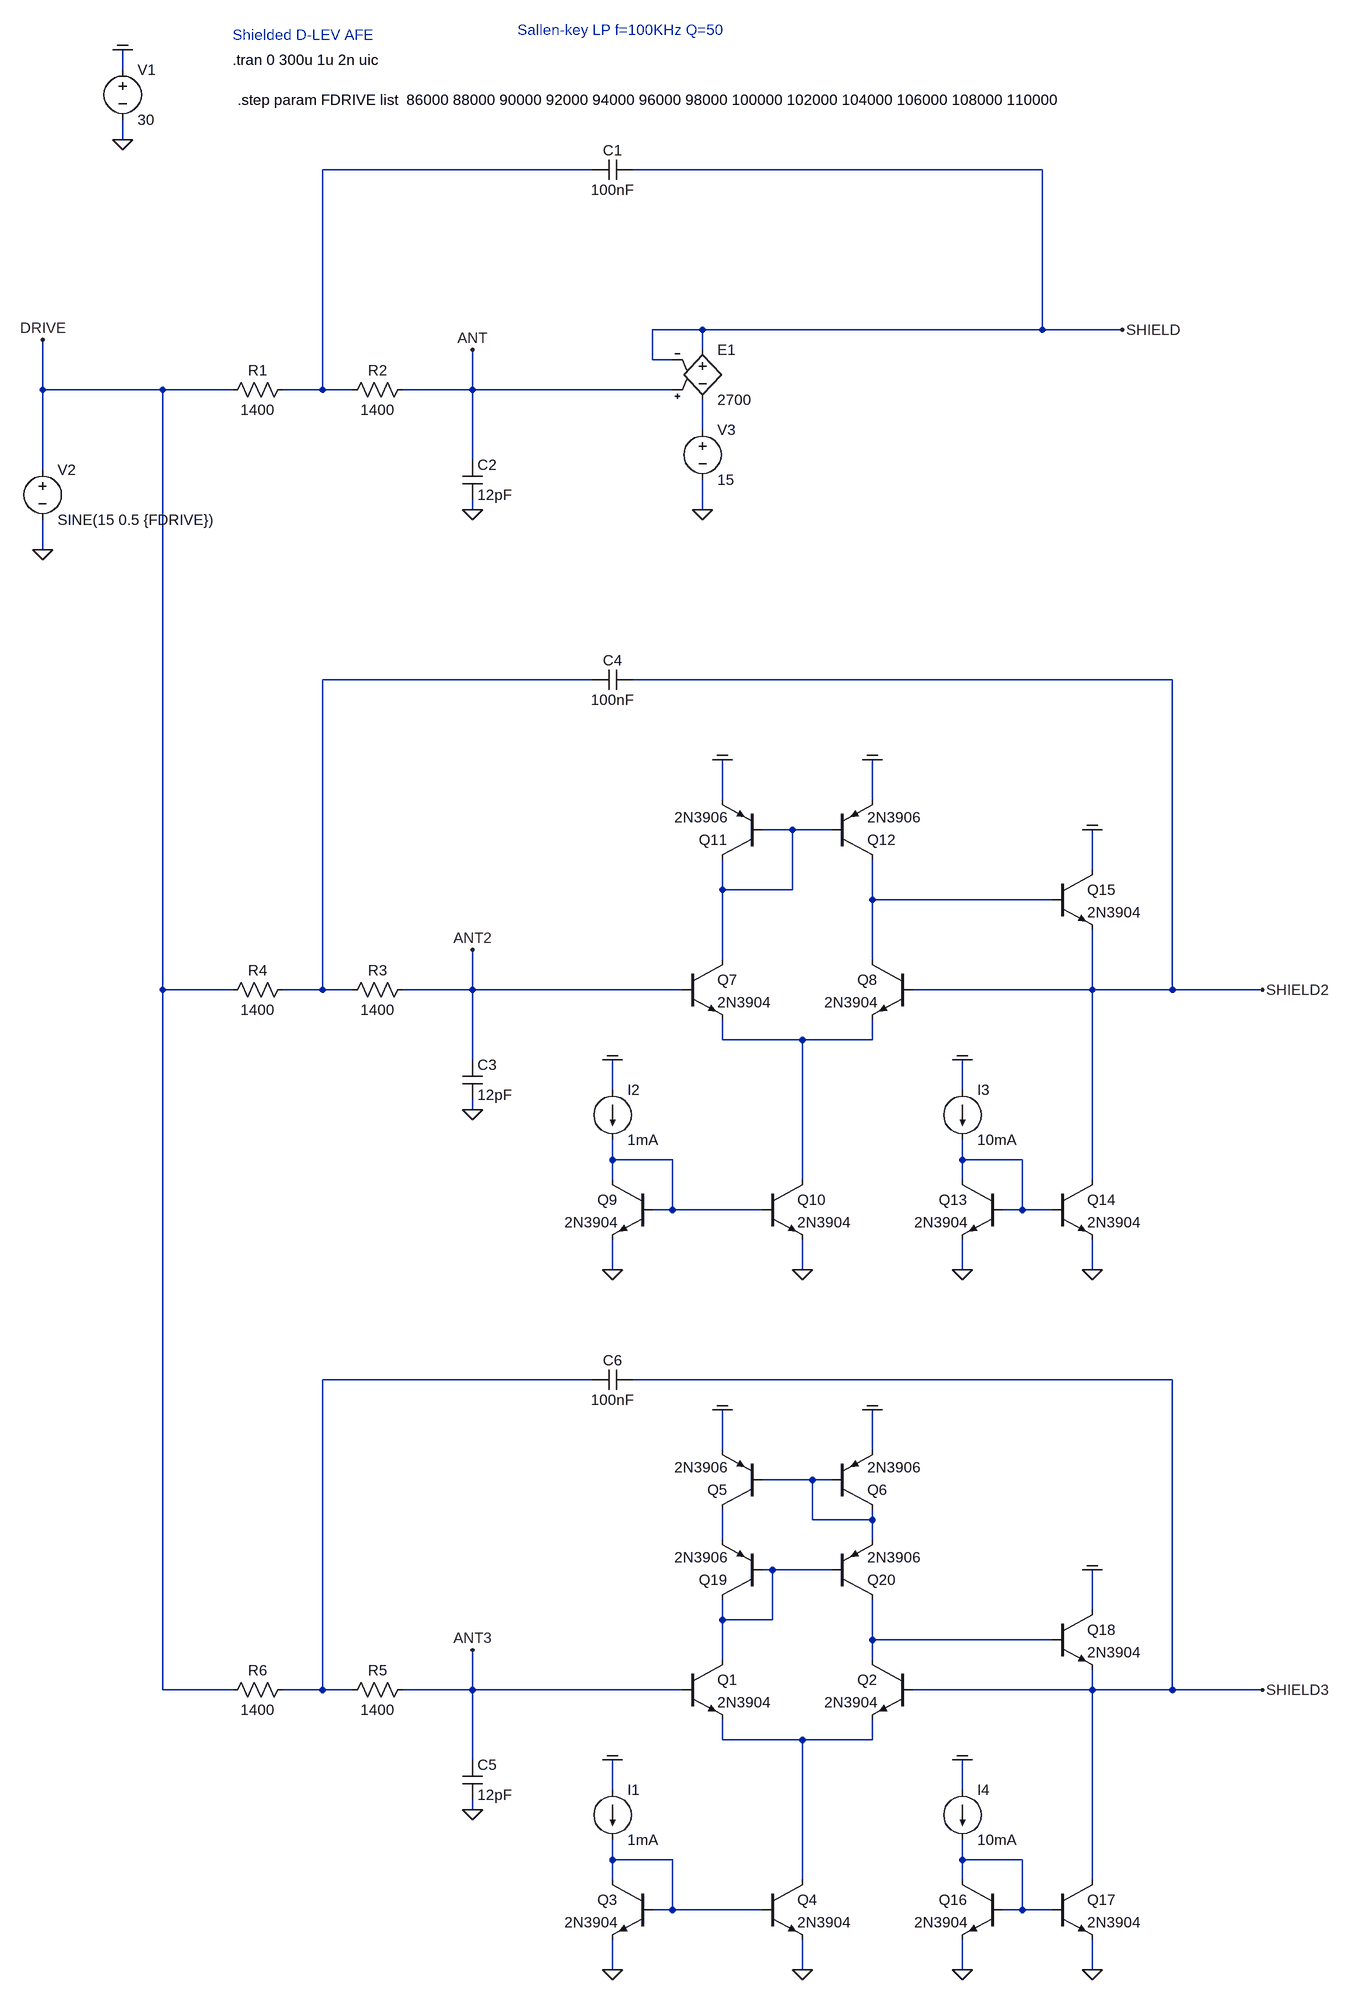
[diagram p0: schematic 2024_01_sallen_key_afe_v04.asc]
2024_01_sallen_key_afe_v04.asc, the LTspice schematic file:
Version 4
SHEET 1 21908 18388
WIRE 17712 14128 17712 14096
WIRE 17712 14240 17712 14208
WIRE 18464 14288 18032 14288
WIRE 19184 14288 18528 14288
WIRE 18640 14544 18560 14544
WIRE 19184 14544 19184 14288
WIRE 19184 14544 18640 14544
WIRE 19312 14544 19184 14544
WIRE 18640 14576 18640 14544
WIRE 18560 14592 18560 14544
WIRE 18592 14592 18560 14592
WIRE 17584 14640 17584 14560
WIRE 17776 14640 17584 14640
WIRE 17888 14640 17776 14640
WIRE 18032 14640 18032 14288
WIRE 18032 14640 17968 14640
WIRE 18080 14640 18032 14640
WIRE 18272 14640 18272 14576
WIRE 18272 14640 18160 14640
WIRE 18592 14640 18272 14640
WIRE 18640 14704 18640 14656
WIRE 18272 14752 18272 14640
WIRE 17584 14768 17584 14640
WIRE 18272 14832 18272 14816
WIRE 18640 14832 18640 14784
WIRE 17584 14896 17584 14848
WIRE 18464 15104 18032 15104
WIRE 19392 15104 18528 15104
WIRE 18672 15296 18672 15232
WIRE 18912 15296 18912 15232
WIRE 18784 15344 18736 15344
WIRE 18848 15344 18784 15344
WIRE 19264 15408 19264 15344
WIRE 18672 15440 18672 15392
WIRE 18784 15440 18784 15344
WIRE 18784 15440 18672 15440
WIRE 18912 15456 18912 15392
WIRE 19200 15456 18912 15456
WIRE 18672 15552 18672 15440
WIRE 18912 15552 18912 15456
WIRE 17776 15600 17776 14640
WIRE 17888 15600 17776 15600
WIRE 18032 15600 18032 15104
WIRE 18032 15600 17968 15600
WIRE 18080 15600 18032 15600
WIRE 18272 15600 18272 15536
WIRE 18272 15600 18160 15600
WIRE 18608 15600 18272 15600
WIRE 19264 15600 19264 15504
WIRE 19264 15600 18976 15600
WIRE 19392 15600 19392 15104
WIRE 19392 15600 19264 15600
WIRE 19536 15600 19392 15600
WIRE 18672 15680 18672 15648
WIRE 18800 15680 18672 15680
WIRE 18912 15680 18912 15648
WIRE 18912 15680 18800 15680
WIRE 18272 15712 18272 15600
WIRE 18496 15760 18496 15712
WIRE 19056 15760 19056 15712
WIRE 18272 15792 18272 15776
WIRE 18496 15872 18496 15840
WIRE 18592 15872 18496 15872
WIRE 19056 15872 19056 15840
WIRE 19152 15872 19056 15872
WIRE 18496 15904 18496 15872
WIRE 18800 15904 18800 15680
WIRE 19056 15904 19056 15872
WIRE 19264 15904 19264 15600
WIRE 18592 15952 18592 15872
WIRE 18592 15952 18560 15952
WIRE 18736 15952 18592 15952
WIRE 19152 15952 19152 15872
WIRE 19152 15952 19120 15952
WIRE 19200 15952 19152 15952
WIRE 18496 16048 18496 16000
WIRE 18800 16048 18800 16000
WIRE 19056 16048 19056 16000
WIRE 19264 16048 19264 16000
WIRE 18464 16224 18032 16224
WIRE 19392 16224 18528 16224
WIRE 18672 16336 18672 16272
WIRE 18912 16336 18912 16272
WIRE 18816 16384 18736 16384
WIRE 18848 16384 18816 16384
WIRE 18816 16448 18816 16384
WIRE 18912 16448 18912 16432
WIRE 18912 16448 18816 16448
WIRE 18672 16480 18672 16432
WIRE 18912 16480 18912 16448
WIRE 18752 16528 18736 16528
WIRE 18848 16528 18752 16528
WIRE 19264 16592 19264 16528
WIRE 18672 16608 18672 16576
WIRE 18752 16608 18752 16528
WIRE 18752 16608 18672 16608
WIRE 18912 16640 18912 16576
WIRE 19200 16640 18912 16640
WIRE 18672 16672 18672 16608
WIRE 18912 16672 18912 16640
WIRE 17776 16720 17776 15600
WIRE 17888 16720 17776 16720
WIRE 18032 16720 18032 16224
WIRE 18032 16720 17968 16720
WIRE 18080 16720 18032 16720
WIRE 18272 16720 18272 16656
WIRE 18272 16720 18160 16720
WIRE 18608 16720 18272 16720
WIRE 19264 16720 19264 16688
WIRE 19264 16720 18976 16720
WIRE 19392 16720 19392 16224
WIRE 19392 16720 19264 16720
WIRE 19536 16720 19392 16720
WIRE 18672 16800 18672 16768
WIRE 18800 16800 18672 16800
WIRE 18912 16800 18912 16768
WIRE 18912 16800 18800 16800
WIRE 18272 16832 18272 16720
WIRE 18496 16880 18496 16832
WIRE 19056 16880 19056 16832
WIRE 18272 16912 18272 16896
WIRE 18496 16992 18496 16960
WIRE 18592 16992 18496 16992
WIRE 19056 16992 19056 16960
WIRE 19152 16992 19056 16992
WIRE 18496 17024 18496 16992
WIRE 18800 17024 18800 16800
WIRE 19056 17024 19056 16992
WIRE 19264 17024 19264 16720
WIRE 18592 17072 18592 16992
WIRE 18592 17072 18560 17072
WIRE 18736 17072 18592 17072
WIRE 19152 17072 19152 16992
WIRE 19152 17072 19120 17072
WIRE 19200 17072 19152 17072
WIRE 18496 17168 18496 17120
WIRE 18800 17168 18800 17120
WIRE 19056 17168 19056 17120
WIRE 19264 17168 19264 17120
FLAG 17712 14240 0
FLAG 17712 14096 COM
FLAG 18272 14832 0
FLAG 17584 14896 0
FLAG 17584 14560 DRIVE
FLAG 18272 14576 ANT
FLAG 19312 14544 SHIELD
FLAG 18272 15792 0
FLAG 18272 15536 ANT2
FLAG 19536 15600 SHIELD2
FLAG 18496 16048 0
FLAG 18800 16048 0
FLAG 18496 15712 COM
FLAG 18672 15232 COM
FLAG 18912 15232 COM
FLAG 19056 16048 0
FLAG 19264 16048 0
FLAG 19056 15712 COM
FLAG 19264 15344 COM
FLAG 18640 14832 0
FLAG 18272 16912 0
FLAG 18272 16656 ANT3
FLAG 19536 16720 SHIELD3
FLAG 18496 17168 0
FLAG 18800 17168 0
FLAG 18496 16832 COM
FLAG 18672 16272 COM
FLAG 18912 16272 COM
FLAG 19056 17168 0
FLAG 19264 17168 0
FLAG 19056 16832 COM
FLAG 19264 16528 COM
SYMBOL voltage 17712 14112 R0
WINDOW 123 0 0 Left 0
WINDOW 39 0 0 Left 0
SYMATTR InstName V1
SYMATTR Value 30
SYMBOL cap 18256 14752 R0
SYMATTR InstName C2
SYMATTR Value 12pF
SYMBOL res 18176 14624 R90
WINDOW 0 0 56 VBottom 2
WINDOW 3 32 56 VTop 2
SYMATTR InstName R2
SYMATTR Value 1400
SYMBOL res 17984 14624 R90
WINDOW 0 0 56 VBottom 2
WINDOW 3 32 56 VTop 2
SYMATTR InstName R1
SYMATTR Value 1400
SYMBOL cap 18464 14272 M90
WINDOW 0 0 32 VBottom 2
WINDOW 3 32 32 VTop 2
SYMATTR InstName C1
SYMATTR Value 100nF
SYMBOL voltage 17584 14752 R0
WINDOW 123 0 0 Left 0
WINDOW 39 0 0 Left 0
SYMATTR InstName V2
SYMATTR Value SINE(15 0.5 {FDRIVE})
SYMBOL e2 18640 14560 R0
SYMATTR InstName E1
SYMATTR Value 2700
SYMBOL cap 18256 15712 R0
SYMATTR InstName C3
SYMATTR Value 12pF
SYMBOL res 18176 15584 R90
WINDOW 0 0 56 VBottom 2
WINDOW 3 32 56 VTop 2
SYMATTR InstName R3
SYMATTR Value 1400
SYMBOL res 17984 15584 R90
WINDOW 0 0 56 VBottom 2
WINDOW 3 32 56 VTop 2
SYMATTR InstName R4
SYMATTR Value 1400
SYMBOL cap 18464 15088 M90
WINDOW 0 0 32 VBottom 2
WINDOW 3 32 32 VTop 2
SYMATTR InstName C4
SYMATTR Value 100nF
SYMBOL npn 18608 15552 R0
SYMATTR InstName Q7
SYMATTR Value 2N3904
SYMBOL npn 18976 15552 M0
SYMATTR InstName Q8
SYMATTR Value 2N3904
SYMBOL npn 18560 15904 M0
SYMATTR InstName Q9
SYMATTR Value 2N3904
SYMBOL npn 18736 15904 R0
SYMATTR InstName Q10
SYMATTR Value 2N3904
SYMBOL pnp 18736 15392 R180
SYMATTR InstName Q11
SYMATTR Value 2N3906
SYMBOL pnp 18848 15392 M180
SYMATTR InstName Q12
SYMATTR Value 2N3906
SYMBOL current 18496 15760 R0
WINDOW 123 0 0 Left 0
WINDOW 39 0 0 Left 0
SYMATTR InstName I2
SYMATTR Value 1mA
SYMBOL npn 19120 15904 M0
SYMATTR InstName Q13
SYMATTR Value 2N3904
SYMBOL npn 19200 15904 R0
SYMATTR InstName Q14
SYMATTR Value 2N3904
SYMBOL current 19056 15760 R0
WINDOW 123 0 0 Left 0
WINDOW 39 0 0 Left 0
SYMATTR InstName I3
SYMATTR Value 10mA
SYMBOL npn 19200 15408 R0
SYMATTR InstName Q15
SYMATTR Value 2N3904
SYMBOL voltage 18640 14688 R0
WINDOW 123 0 0 Left 0
WINDOW 39 0 0 Left 0
SYMATTR InstName V3
SYMATTR Value 15
SYMBOL cap 18256 16832 R0
SYMATTR InstName C5
SYMATTR Value 12pF
SYMBOL res 18176 16704 R90
WINDOW 0 0 56 VBottom 2
WINDOW 3 32 56 VTop 2
SYMATTR InstName R5
SYMATTR Value 1400
SYMBOL res 17984 16704 R90
WINDOW 0 0 56 VBottom 2
WINDOW 3 32 56 VTop 2
SYMATTR InstName R6
SYMATTR Value 1400
SYMBOL cap 18464 16208 M90
WINDOW 0 0 32 VBottom 2
WINDOW 3 32 32 VTop 2
SYMATTR InstName C6
SYMATTR Value 100nF
SYMBOL npn 18608 16672 R0
SYMATTR InstName Q1
SYMATTR Value 2N3904
SYMBOL npn 18976 16672 M0
SYMATTR InstName Q2
SYMATTR Value 2N3904
SYMBOL npn 18560 17024 M0
SYMATTR InstName Q3
SYMATTR Value 2N3904
SYMBOL npn 18736 17024 R0
SYMATTR InstName Q4
SYMATTR Value 2N3904
SYMBOL pnp 18736 16432 R180
SYMATTR InstName Q5
SYMATTR Value 2N3906
SYMBOL pnp 18848 16432 M180
SYMATTR InstName Q6
SYMATTR Value 2N3906
SYMBOL current 18496 16880 R0
WINDOW 123 0 0 Left 0
WINDOW 39 0 0 Left 0
SYMATTR InstName I1
SYMATTR Value 1mA
SYMBOL npn 19120 17024 M0
SYMATTR InstName Q16
SYMATTR Value 2N3904
SYMBOL npn 19200 17024 R0
SYMATTR InstName Q17
SYMATTR Value 2N3904
SYMBOL current 19056 16880 R0
WINDOW 123 0 0 Left 0
WINDOW 39 0 0 Left 0
SYMATTR InstName I4
SYMATTR Value 10mA
SYMBOL npn 19200 16592 R0
SYMATTR InstName Q18
SYMATTR Value 2N3904
SYMBOL pnp 18736 16576 R180
SYMATTR InstName Q19
SYMATTR Value 2N3906
SYMBOL pnp 18848 16576 M180
SYMATTR InstName Q20
SYMATTR Value 2N3906
TEXT 17888 14112 Left 2 !.tran 0 300u 1u 2n uic
TEXT 17888 14072 Left 2 ;Shielded D-LEV AFE
TEXT 18344 14064 Left 2 ;Sallen-key LP f=100KHz Q=50
TEXT 17896 14176 Left 2 !.step param FDRIVE list  86000 88000 90000 92000 94000 96000 98000 100000 102000 104000 106000 108000 110000

The netlist it stands for:
* 2024_01_sallen_key_afe_v04.asc
V1 COM 0 30
C2 ANT 0 12pF
R2 ANT N001 1400
R1 N001 DRIVE 1400
C1 N001 SHIELD 100nF
V2 DRIVE 0 SINE(15 0.5 {FDRIVE})
E1 SHIELD N002 ANT SHIELD 2700
C3 ANT2 0 12pF
R3 ANT2 N003 1400
R4 N003 DRIVE 1400
C4 N003 SHIELD2 100nF
Q7 N004 ANT2 N006 0 2N3904
Q8 N005 SHIELD2 N006 0 2N3904
Q9 N007 N007 0 0 2N3904
Q10 N006 N007 0 0 2N3904
Q11 N004 N004 COM 0 2N3906
Q12 N005 N004 COM 0 2N3906
I2 COM N007 1mA
Q13 N008 N008 0 0 2N3904
Q14 SHIELD2 N008 0 0 2N3904
I3 COM N008 10mA
Q15 COM N005 SHIELD2 0 2N3904
V3 N002 0 15
C5 ANT3 0 12pF
R5 ANT3 N009 1400
R6 N009 DRIVE 1400
C6 N009 SHIELD3 100nF
Q1 N012 ANT3 N014 0 2N3904
Q2 N013 SHIELD3 N014 0 2N3904
Q3 N015 N015 0 0 2N3904
Q4 N014 N015 0 0 2N3904
Q5 N011 N010 COM 0 2N3906
Q6 N010 N010 COM 0 2N3906
I1 COM N015 1mA
Q16 N016 N016 0 0 2N3904
Q17 SHIELD3 N016 0 0 2N3904
I4 COM N016 10mA
Q18 COM N013 SHIELD3 0 2N3904
Q19 N012 N012 N011 0 2N3906
Q20 N013 N012 N010 0 2N3906
.model NPN NPN
.model PNP PNP
.lib standard.bjt
.tran 0 300u 1u 2n uic
* Shielded D-LEV AFE
* Sallen-key LP f=100KHz Q=50
.step param FDRIVE list  86000 88000 90000 92000 94000 96000 98000 100000 102000 104000 106000 108000 110000
.backanno
.end